# Altium project RF315.PrjPcb
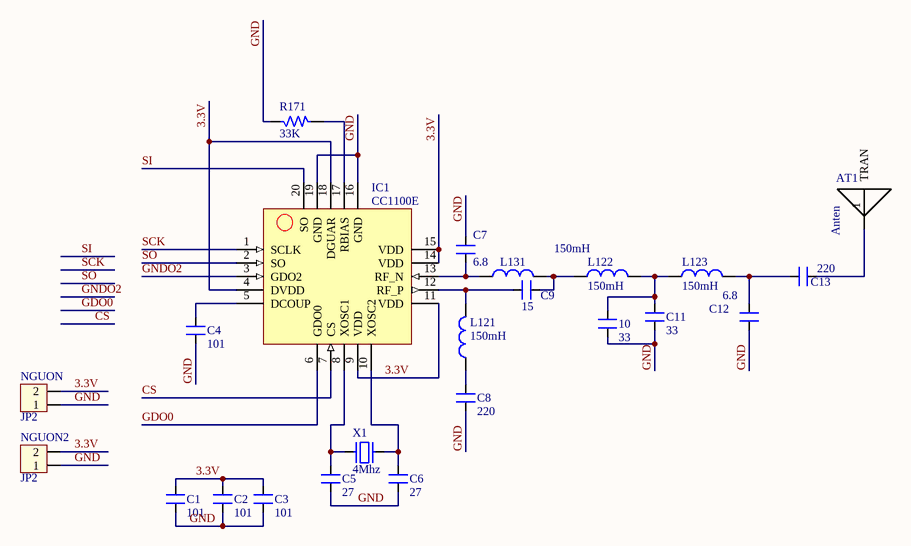
[diagram p0: RF315.SchDoc]
1 sheet, 23 parts. Net scope: global (net labels, ports and power ports of the same name join across sheets).
Board file: RF315.PcbDoc

## Sheet RF315.SchDoc
size A

### Parts
10  33  [SM-0805]
AT1  Anten  [VIT]
C1  101  [SM-0805]
C2  101  [SM-0805]
C3  101  [SM-0805]
C4  101  [SM-0805]
C5  27  [SM-0805]
C6  27  [SM-0805]
C7  6.8  [SM-0805]
C8  220  [SM-0805]
C9  15  [SM-0805]
C11  33  [SM-0805]
C12  6.8  [SM-0805]
C13  220  [SM-0805]
IC1  CC1100E  [CC1101-20P]
L121  150mH  [L/0.4]
L122  150mH  [L/0.4]
L123  150mH  [L/0.4]
L131  150mH  [L/0.4]
NGUON  JP2  [CON2]
NGUON2  JP2  [CON2]
R171  33K  [SM-0805]
X1  4Mhz  [CP1/2.5_SM]

### Nets
3.3V: C1.1 C2.1 C3.1 IC1.4(DVDD) IC1.9(VDD) IC1.11(VDD) IC1.14(VDD) IC1.15(VDD) IC1.18(DGUAR) NGUON.2 NGUON2.2
CS: IC1.7(CS)
GDO0: IC1.6(GDO0)
GND: 10.1 C1.2 C2.2 C3.2 C4.2 C5.2 C6.2 C7.2 C8.1 C11.1 C12.1 IC1.16(GND) IC1.19(GND) NGUON.1 NGUON2.1 R171.1
GNDO2: IC1.3(GDO2)
SCK: IC1.1(SCLK)
SI: IC1.20(SO)
SO: IC1.2(SO)
Net10_2: 10.2 C11.2 L122.2 L123.1
NetAT1_1: AT1.1(TRAN) C13.1
NetC4_1: C4.1 IC1.5(DCOUP)
NetC5_1: C5.1 IC1.8(XOSC1) X1.1
NetC6_1: C6.1 IC1.10(XOSC2) X1.2
NetC7_1: C7.1 IC1.13(RF_N) L131.1
NetC8_2: C8.2 L121.1
NetC9_1: C9.1 IC1.12(RF_P) L121.2
NetC9_2: C9.2 L122.1 L131.2
NetC12_2: C12.2 C13.2 L123.2
NetIC1_17: IC1.17(RBIAS) R171.2

### Library data of the parts
10 C1-C9 C11-C13 = CM: Cap SMD; Value: 103
L121-L123 L131 = L1: Inductor; Value: 150 mH
NGUON NGUON2 = Con2: Connector 2; Value: Connector 2
R171 = R: Resistor 1/4W; Value: R1/4W - 1K
X1 = XT2: Crystal For all Crystal 2pin.; Value: 4Mhz